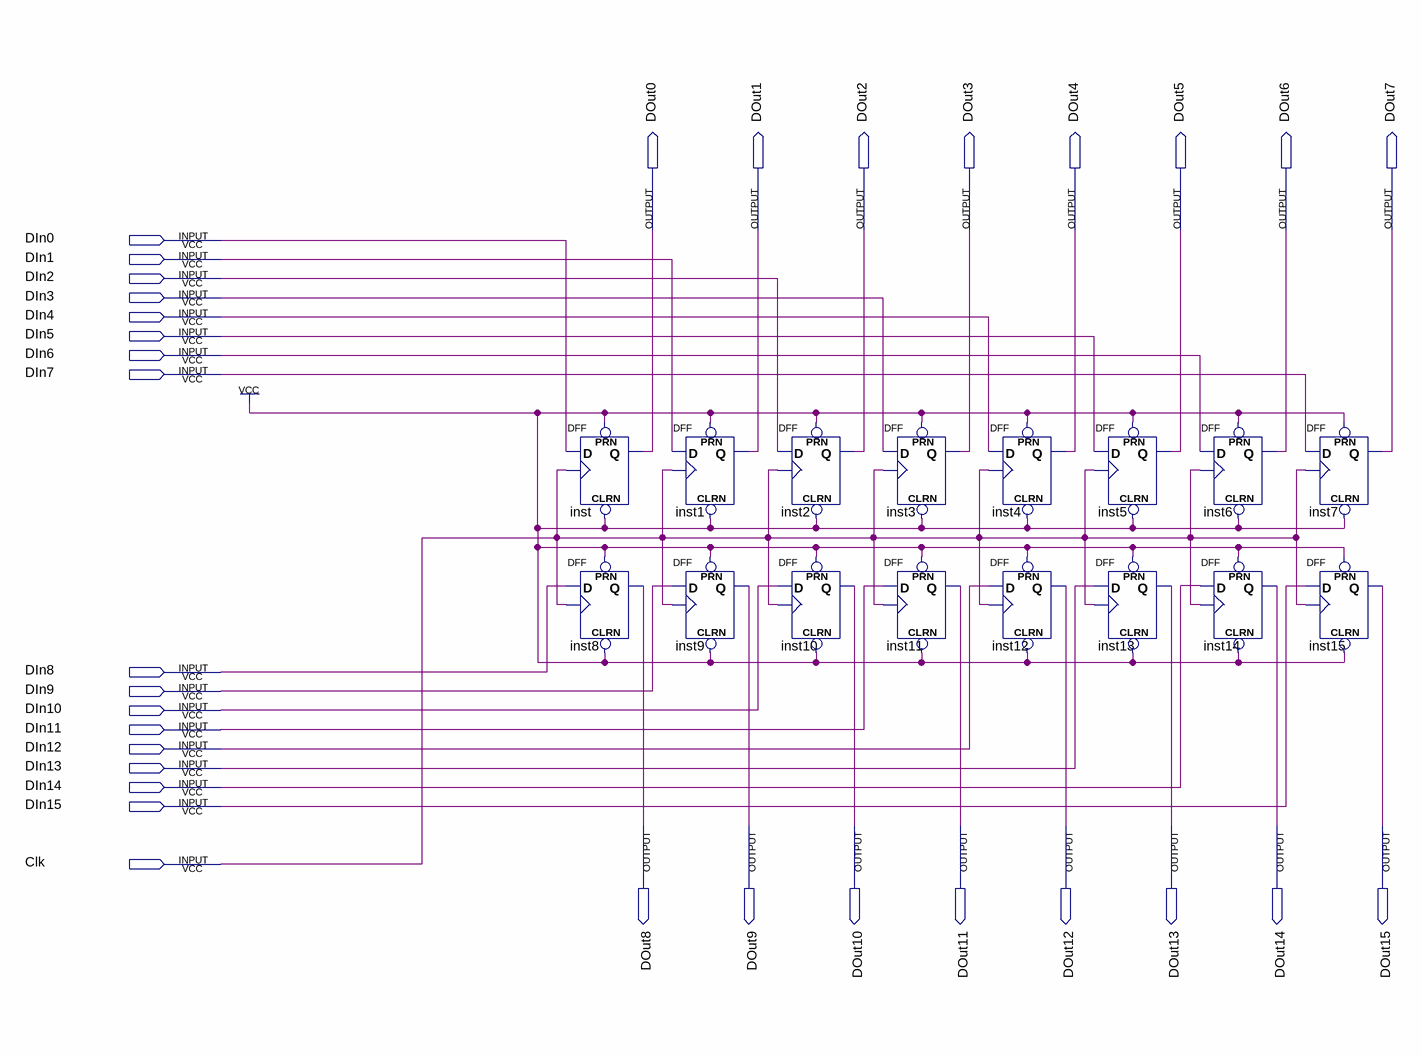
[diagram p0: schematic sheet]
// Quartus schematic Input_Register.bdf as structural Verilog: 16 symbols, 33 pins
module Input_Register (
  input  DIn0,
  input  DIn1,
  input  DIn2,
  input  DIn3,
  input  DIn4,
  input  DIn5,
  input  DIn6,
  input  DIn7,
  input  DIn8,
  input  DIn9,
  input  DIn10,
  input  DIn11,
  input  DIn12,
  input  DIn13,
  input  DIn14,
  input  DIn15,
  input  Clk,
  output DOut0,
  output DOut1,
  output DOut2,
  output DOut3,
  output DOut4,
  output DOut5,
  output DOut6,
  output DOut7,
  output DOut8,
  output DOut9,
  output DOut10,
  output DOut11,
  output DOut12,
  output DOut13,
  output DOut14,
  output DOut15
);

  DFF inst (.CLRN(1'b1), .CLK(Clk), .D(DIn0), .PRN(1'b1), .Q(DOut0));
  DFF inst8 (.CLRN(1'b1), .CLK(Clk), .D(DIn8), .PRN(1'b1), .Q(DOut8));
  DFF inst1 (.CLRN(1'b1), .CLK(Clk), .D(DIn1), .PRN(1'b1), .Q(DOut1));
  DFF inst9 (.CLRN(1'b1), .CLK(Clk), .D(DIn9), .PRN(1'b1), .Q(DOut9));
  DFF inst2 (.CLRN(1'b1), .CLK(Clk), .D(DIn2), .PRN(1'b1), .Q(DOut2));
  DFF inst10 (.CLRN(1'b1), .CLK(Clk), .D(DIn10), .PRN(1'b1), .Q(DOut10));
  DFF inst3 (.CLRN(1'b1), .CLK(Clk), .D(DIn3), .PRN(1'b1), .Q(DOut3));
  DFF inst11 (.CLRN(1'b1), .CLK(Clk), .D(DIn11), .PRN(1'b1), .Q(DOut11));
  DFF inst4 (.CLRN(1'b1), .CLK(Clk), .D(DIn4), .PRN(1'b1), .Q(DOut4));
  DFF inst12 (.CLRN(1'b1), .CLK(Clk), .D(DIn12), .PRN(1'b1), .Q(DOut12));
  DFF inst5 (.CLRN(1'b1), .CLK(Clk), .D(DIn5), .PRN(1'b1), .Q(DOut5));
  DFF inst13 (.CLRN(1'b1), .CLK(Clk), .D(DIn13), .PRN(1'b1), .Q(DOut13));
  DFF inst6 (.CLRN(1'b1), .CLK(Clk), .D(DIn6), .PRN(1'b1), .Q(DOut6));
  DFF inst14 (.CLRN(1'b1), .CLK(Clk), .D(DIn14), .PRN(1'b1), .Q(DOut14));
  DFF inst7 (.CLRN(1'b1), .CLK(Clk), .D(DIn7), .PRN(1'b1), .Q(DOut7));
  DFF inst15 (.CLRN(1'b1), .CLK(Clk), .D(DIn15), .PRN(1'b1), .Q(DOut15));
endmodule
